# EAGLE schematic EXT_SMART (EAGLE 9.3.1)
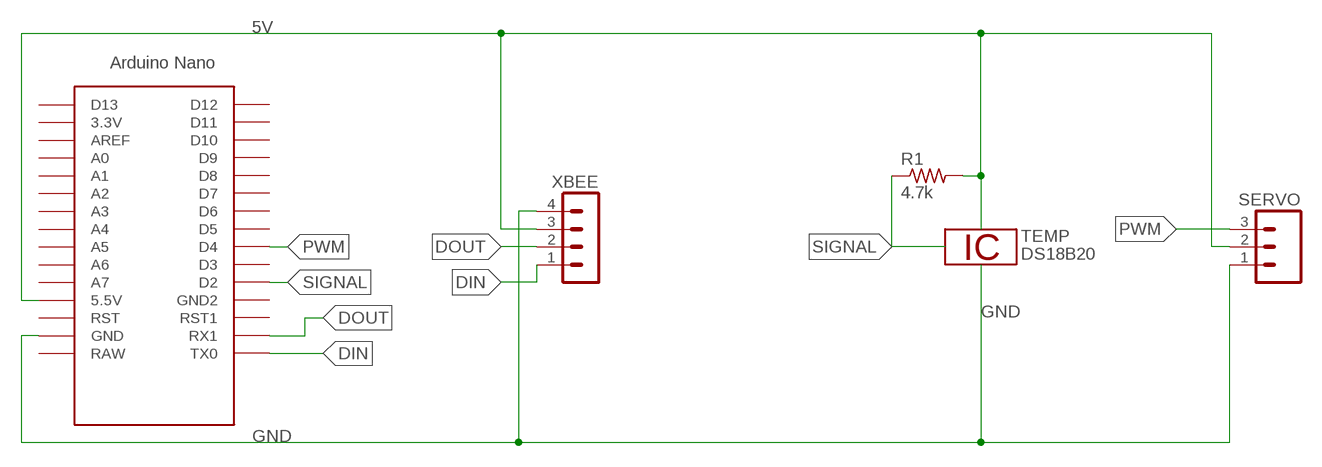
[diagram p0: schematic, sheet 1]

## Parts
R1  4.7k  R-US_0204/7  [0204/7]
SERVO  M03  [03P]
TEMP  DS18B20  [TO92-]
U$1  NANO  [NANO]
XBEE  MA04-1  [MA04-1]

## Nets
5V: R1.2 SERVO.2 U$1.5V(5.5V) XBEE.3
DIN: U$1.TX0 XBEE.1
DOUT: U$1.RX1 XBEE.2
GND: SERVO.1 U$1.GND XBEE.4
PWM: SERVO.3 U$1.D4
SIGNAL: R1.1 U$1.D2
Unconnected: U$1.3.3V U$1.A0 U$1.A1 U$1.A2 U$1.A3 U$1.A4 U$1.A5 U$1.A6 U$1.A7 U$1.AREF U$1.D3 U$1.D5 U$1.D6 U$1.D7 U$1.D8 U$1.D9 U$1.D10 U$1.D11 U$1.D12 U$1.D13 U$1.GND1(GND2) U$1.ICSP1 U$1.ICSP2 U$1.ICSP3 U$1.ICSP4 U$1.ICSP5 U$1.ICSP6 U$1.RAW U$1.RST U$1.RST1

## Power pins joined to a net without a drawn wire
1W: TEMP.2
GND: TEMP.1
VDD: TEMP.3

## Library data of the parts
R1 = resistor:R-US_: RESISTOR, American symbol
SERVO = con-amp-quick:M03: AMP QUICK CONNECTOR; OC_FARNELL: unknown; OC_NEWARK: unknown
TEMP = 1wire:DS18B20: Programmable Resolution Digital Thermometer This chip provides a onewire thermosensor with approx. 0.5°C accuracy. A programmable over/undertemperure alarm is available. The precision can be set from 9..12 bits. Notes: Vdd must be applied for accurate measurements at low temperatures, as the parasite power circuit otherwise heats the sensor. If parasite power is used, Vdd has to be connected to GND. The DS1822 is a low-cost thermometer chip, the DS18S20 is similar to the DS18B20, but with 9 Bit precision only. Author: Jan Kandziora <jjj@gmx.de>
U$1 = Arduino-clone:NANO: Arduino Nano
XBEE = con-lstb:MA04-1: PIN HEADER; OC_FARNELL: unknown; OC_NEWARK: unknown